# Altium schematic sheet Sheet2.SchDoc
size 279 x 215 mm
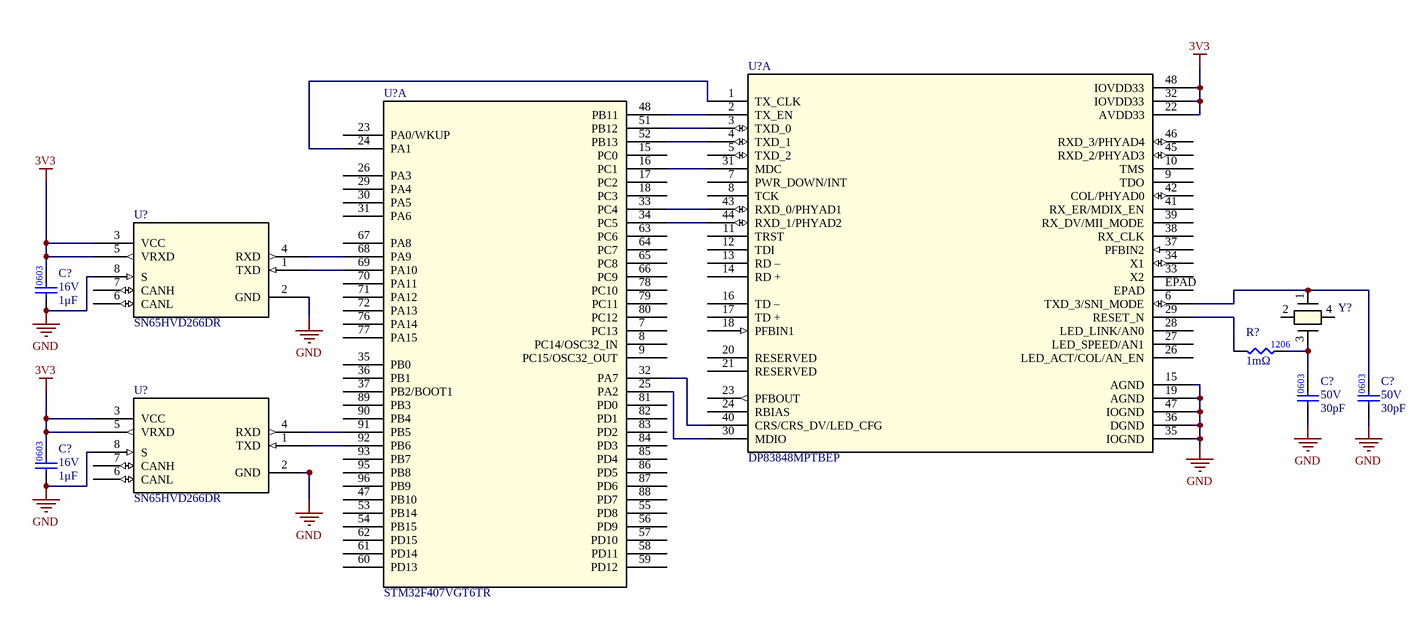
[diagram p0: Sheet2.SchDoc]

## Parts
(Parts that share a designator on the sheet are numbered #1, #2 ... from top to bottom, then left to right.)
C?#1  value 1μF  Voltage Rating: 16V  [CAP0603]  (hidden comment: CAP_1uF_16V_0603)
C?#2  value 30pF  Voltage Rating: 50V  [CAP0603]  (hidden comment: CAP_30pF_50V_0603_1)
C?#3  value 30pF  Voltage Rating: 50V  [CAP0603]  (hidden comment: CAP_30pF_50V_0603_1)
C?#4  value 1μF  Voltage Rating: 16V  [CAP0603]  (hidden comment: CAP_1uF_16V_0603)
R?  value 1mΩ  [RESC3116X65N]  (hidden comment: RES_1mΩ_1206_1%)
U?#1  DP83848MPTBEP  [QFP_PTBEP_TEX]  (part A of 2)
U?#2  STM32F407VGT6TR  [LQFP100-14x14mm]  (part A of 3)
U?#3  SN65HVD266DR  [D8_TEX]
U?#4  SN65HVD266DR  [D8_TEX]
Y?  ABM3C-25.000MHZ-D4Y-T  [CRYSTAL_ABM3C_ABR]  (value not drawn)

## Nets
3V3: C?#1.2 C?#4.2 U?#1.22(AVDD33) U?#1.32(IOVDD33) U?#1.48(IOVDD33) U?#3.3(VCC) U?#3.5(VRXD) U?#4.3(VCC) U?#4.5(VRXD)
GND: C?#1.1 C?#2.1 C?#3.1 C?#4.1 U?#1.15(AGND) U?#1.19(AGND) U?#1.35(IOGND) U?#1.36(DGND) U?#1.47(IOGND) U?#3.2(GND) U?#3.8(S) U?#4.2(GND) U?#4.8(S)
NetC?#2_2: C?#2.2 R?.2 Y?.3
NetC?#3_2: C?#3.2 U?#1.6(TXD_3/SNI_MODE) Y?.1
NetR?_1: R?.1 U?#1.29(RESET_N)
NetU?#1_1: U?#1.1(TX_CLK) U?#2.24(PA1)
NetU?#1_2: U?#1.2(TX_EN) U?#2.48(PB11)
NetU?#1_3: U?#1.3(TXD_0) U?#2.51(PB12)
NetU?#1_4: U?#1.4(TXD_1) U?#2.52(PB13)
NetU?#1_30: U?#1.30(MDIO) U?#2.25(PA2)
NetU?#1_31: U?#1.31(MDC) U?#2.16(PC1)
NetU?#1_40: U?#1.40(CRS/CRS_DV/LED_CFG) U?#2.32(PA7)
NetU?#1_43: U?#1.43(RXD_0/PHYAD1) U?#2.33(PC4)
NetU?#1_44: U?#1.44(RXD_1/PHYAD2) U?#2.34(PC5)
NetU?#2_68: U?#2.68(PA9) U?#3.4(RXD)
NetU?#2_69: U?#2.69(PA10) U?#3.1(TXD)
NetU?#2_91: U?#2.91(PB5) U?#4.4(RXD)
NetU?#2_92: U?#2.92(PB6) U?#4.1(TXD)

Not connected (* = marked no-connect by the designer): U?#1 5(TXD_2) 7(PWR_DOWN/INT) 8(TCK) 9(TDO) 10(TMS) 11(TRST) 12(TDI) 13(RD_–) 14(RD_+) 16(TD_–) 17(TD_+) 18(PFBIN1) 20(RESERVED) 21(RESERVED) 23(PFBOUT) 24(RBIAS) 26(LED_ACT/COL/AN_EN) 27(LED_SPEED/AN1) 28(LED_LINK/AN0) 33(X2) 34(X1) 37(PFBIN2) 38(RX_CLK) 39(RX_DV/MII_MODE) 41(RX_ER/MDIX_EN) 42(COL/PHYAD0) 45(RXD_2/PHYAD3) 46(RXD_3/PHYAD4) EPAD; U?#2 7(PC13) 8(PC14/OSC32_IN) 9(PC15/OSC32_OUT) 15(PC0) 17(PC2) 18(PC3) 23(PA0/WKUP) 26(PA3) 29(PA4) 30(PA5) 31(PA6) 35(PB0) 36(PB1) 37(PB2/BOOT1) 47(PB10) 53(PB14) 54(PB15) 55(PD8) 56(PD9) 57(PD10) 58(PD11) 59(PD12) 60(PD13) 61(PD14) 62(PD15) 63(PC6) 64(PC7) 65(PC8) 66(PC9) 67(PA8) 70(PA11) 71(PA12) 72(PA13) 76(PA14) 77(PA15) 78(PC10) 79(PC11) 80(PC12) 81(PD0) 82(PD1) 83(PD2) 84(PD3) 85(PD4) 86(PD5) 87(PD6) 88(PD7) 89(PB3) 90(PB4) 93(PB7) 95(PB8) 96(PB9); U?#3 6(CANL) 7(CANH); U?#4 6(CANL) 7(CANH); Y? 2 4

## Notes on the sheet
- University of Waterloo Robotics Team
- 200 University Ave W
- REV
- PROJECT
- Waterloo, Ontario, Canada
- N2L 3G1
- DOCUMENT
- ENGINEER
- REVIEWER
- MODIFIED
- SHEET
- OF
- (in symbol CAP_30pF_50V_0603_1) 0603

## Library data of the parts
C?#1 C?#4 = CAP_1uF_16V_0603: CAP CER 1UF 16V Y5V 0603; Manufacturer 1: Yageo; Manufacturer Part Number 1: CC0603ZRY5V7BB105; Supplier Part Number 1: 311-1372-1-ND; Supplier 1: Digi-Key; Mounting Type: SMD; Package: 0603; Dielectric: Y5V
C?#2 C?#3 = CAP_30pF_50V_0603_1: 30 pF ±5% 50V Ceramic Capacitor C0G, NP0 0603 (1608 Metric); Manufacturer Part Number 1: GCM188R71C334KA37D; Manufacturer 1: Murata Electronics North America; Dielectric: X7R; Supplier 1: Digikey; Supplier Part Number 1: 478-7917-1-ND
R? = RES_1mΩ_1206_1%: RES 0.001 OHM 1% 1W 1206; Manufacturer 1: Delta Electronics/Cyntec; Manufacturer Part Number 1: RL1632T4F-R001-FNH; Package/Footprint: 1206; Mounting Type: SMD; Supplier 1: Digi-Key; Supplier Part Number 1: 2037-RL1632T4F-R001-FNHCT-ND
U?#1 = DP83848MPTBEP: No Description Available; Mfr_Name: Texas Instruments; RefDes: RefDes; Type: Type
U?#2 = STM32F407VGT6TR: ARM® Cortex®-M4 STM32F4 Microcontroller IC 32-Bit Single-Core 168MHz 1MB (1M x 8) FLASH 100-LQFP (14x14); Mfr_Name: STMicroelectronics; Connectivity: CANbus, DCMI, EBI/EMI, Ethernet, I2C, IrDA, LINbus, SPI, UART/USART, USB OTG; Peripherals: Brown-out Detect/Reset, DMA, I2S, LCD, POR, PWM, WDT; Core Processor: ARM® Cortex®-M4; Core Size: 32-Bit Single-Core; Supplier Device Package: 100-LQFP (14x14)
U?#3 U?#4 = SN65HVD266DR: No Description Available; Mfr_Name: Texas Instruments; RefDes: RefDes; Type: Type
Y? = ABM3C-25.000MHZ-D4Y-T: No Description Available; Mfr_Name: Abracon